# Altium schematic sheet Input Protection.SchDoc
size A4; SheetNumber: 4; SheetTotal: 10
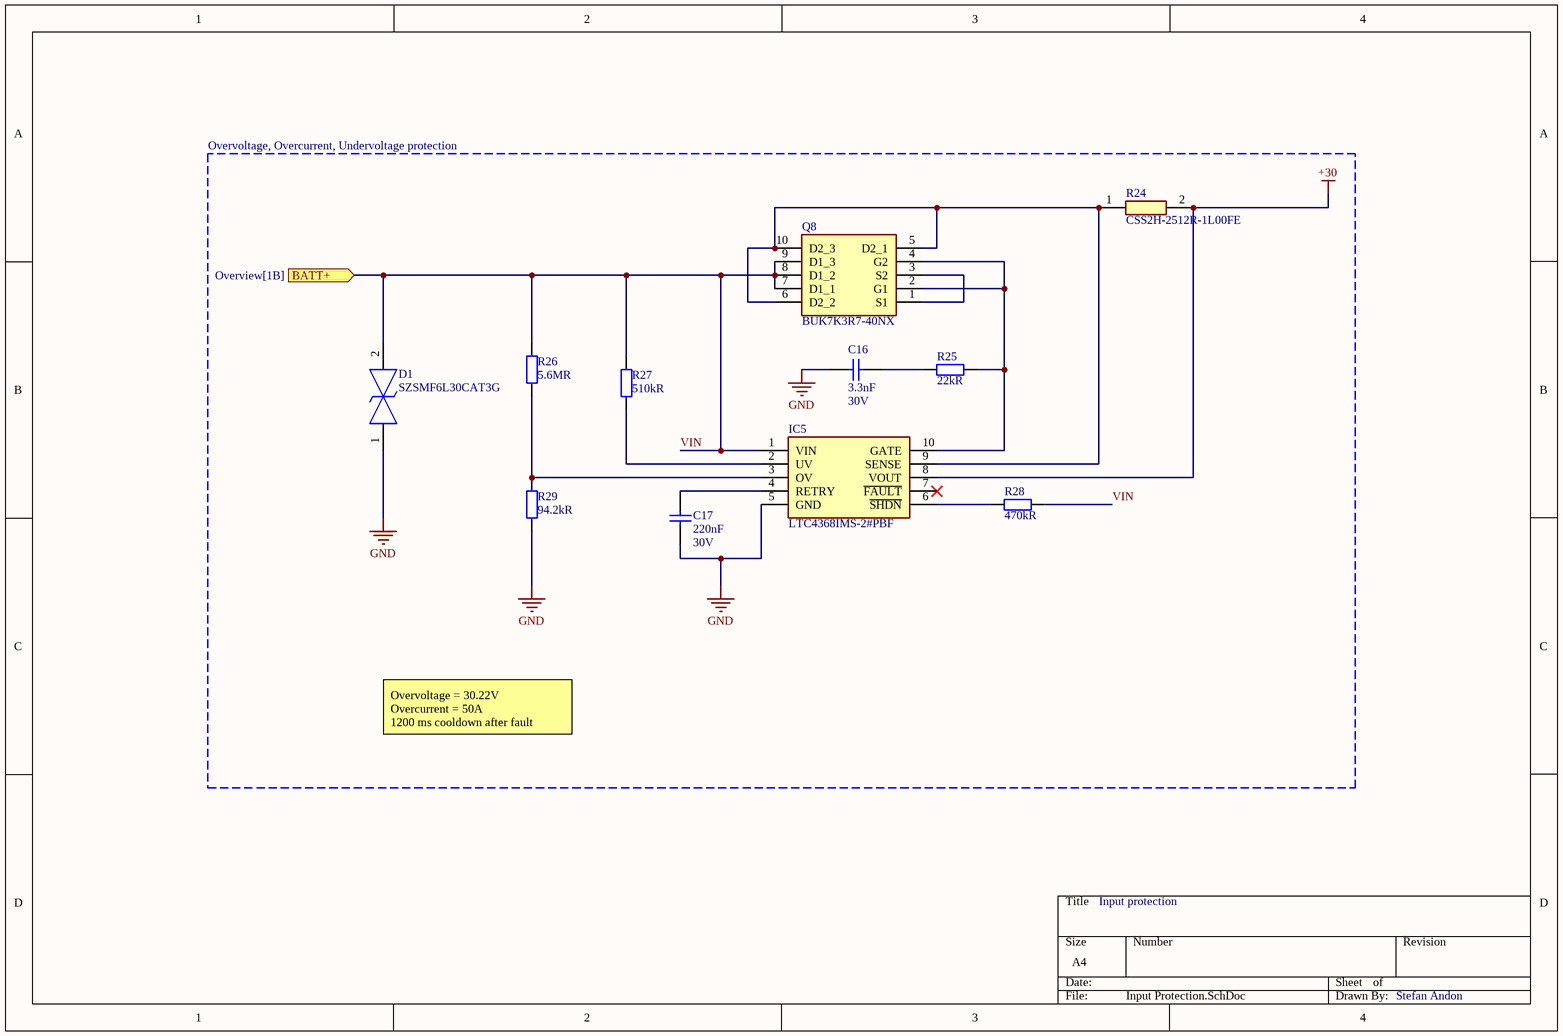
[diagram p0: Input Protection.SchDoc]

## Parts
C16  value 3.3nF  Voltage: 30V  [CAP_0603]  (hidden comment: Capacitor_SMD)
C17  value 220nF  Voltage: 30V  [CAP_0603]  (hidden comment: Capacitor_SMD)
D1  SZSMF6L30CAT3G  [SMFA2005CA]
IC5  LTC4368IMS-2#PBF  [SOP50P490X110-10N]
Q8  BUK7K3R7-40NX  [BUK7K29100EX]
R24  CSS2H-2512R-1L00FE  [CSS2H2512R1L00FE]
R25  value 22kR  [RES_0603]  (hidden comment: Resistor_SMD)
R26  value 5.6MR  [RES_0603]  (hidden comment: Resistor_SMD)
R27  value 510kR  [RES_0603]  (hidden comment: Resistor_SMD)
R28  value 470kR  [RES_0603]  (hidden comment: Resistor_SMD)
R29  value 94.2kR  [RES_0603]  (hidden comment: Resistor_SMD)

## Blocks framed on the sheet
Overvoltage, Overcurrent, Undervoltage protection: C16 C17 D1 IC5 Q8 R24-R29

## Ports
BATT+ (in, see Overview[1B])

## Nets
+30: IC5.8(VOUT) R24.2
GND: C16.2 C17.2 D1.1 IC5.5(GND) R29.1
VIN: D1.2 IC5.1(VIN) Q8.7(D1_1) Q8.8(D1_2) Q8.9(D1_3) R26.2 R27.2 R28.1 ; port BATT+
NetC16_1: C16.1 R25.1
NetC17_1: C17.1 IC5.4(RETRY)
NetIC5_2: IC5.2(UV) R27.1
NetIC5_3: IC5.3(OV) R26.1 R29.2
NetIC5_6: IC5.6(~{SHDN}) R28.2
NetIC5_9: IC5.9(SENSE) Q8.5(D2_1) Q8.6(D2_2) Q8.10(D2_3) R24.1
NetIC5_10: IC5.10(GATE) Q8.2(G1) Q8.4(G2) R25.2
NetQ8_1: Q8.1(S1) Q8.3(S2)

Not connected (* = marked no-connect by the designer): IC5 7(~{FAULT})*

## Notes on the sheet
- Overvoltage = 30.22V
  Overcurrent = 50A
  1200 ms cooldown after fault
- Input protection
- Stefan Andon

## Library data of the parts
C16 = CMP-001-0004-13: SMD Capacitor; Tolerance: tbd; BOM: 3.3nF, 30V, tbd, tbd,CAP_0603; Dielectric: tbd; Package: tbd
C17 = CMP-001-0004-13: SMD Capacitor; Tolerance: tbd; BOM: 220nF, 30V, tbd, tbd,CAP_0603; Dielectric: tbd; Package: tbd
D1 = SZSMF6L30CAT3G: TVS Diode (Bi-directional); Manufacturer_Name: LITTELFUSE; Datasheet Link: https://cdn1-originals.webdamdb.com/14154_163817421?cache=1753841810&response-content-disposition=inline;filename=TVS_Diode_SZSMF6L_2025-5-16.pdf&response-content-type=application/pdf&Policy=eyJTdGF0ZW1lbnQiOlt7IlJlc291cmNlIjoiaHR0cCo6Ly9jZG4xLW9yaWdpbmFs; Height: 1.08mm; Manufacturer_Part_Number: SZSMF6L30CAT3G
IC5 = LTC4368IMS-2#PBF: Integrated Circuit; Manufacturer_Name: Analog Devices; Datasheet Link: https://www.arrow.com/en/products/ltc4368ims-2pbf/analog-devices; Height: 1.1mm; Manufacturer_Part_Number: LTC4368IMS-2#PBF; Mouser Part Number: 584-LTC4368IMS2PBF; Mouser Price/Stock: https://www.mouser.co.uk/ProductDetail/Analog-Devices/LTC4368IMS-2PBF?qs=5aG0NVq1C4yQGBsRaTKLEg%3D%3D; Arrow Part Number: LTC4368IMS-2#PBF; Arrow Price/Stock: https://www.arrow.com/en/products/ltc4368ims-2pbf/analog-devices?region=nac
Q8 = BUK7K3R7-40NX: MOSFET (N-Channel); Manufacturer_Name: Nexperia; Datasheet Link: https://assets.nexperia.com/documents/data-sheet/BUK7K3R7-40N.pdf; Height: 1.15mm; Manufacturer_Part_Number: BUK7K3R7-40NX
R24 = CSS2H-2512R-1L00FE: Resistor; Manufacturer_Name: Bourns; Datasheet Link: http://www.bourns.com/docs/Product-Datasheets/css2h-2512.pdf; Height: 0.87mm; Manufacturer_Part_Number: CSS2H-2512R-1L00FE; Mouser Part Number: 652-CSS2H2512R1L00FE; Mouser Price/Stock: https://www.mouser.co.uk/ProductDetail/Bourns/CSS2H-2512R-1L00FE?qs=jDo7WO9B8muVb3lAsH3s1A%3D%3D; Arrow Part Number: CSS2H-2512R-1L00FE; Arrow Price/Stock: https://www.arrow.com/en/products/css2h-2512r-1l00fe/bourns?utm_currency=USD&region=nac
R25-R29 = CMP-001-0003-18: Tolerance: tbd; Power: 7W; BOM: Value+', '+Power+', '+Tolerance+', '+CurrentFootprint; Package: tbd